# EasyEDA Pro project COBOT_Braço_Robotico.eprj

# Schematic Esquema Geral

## Sheets
1 Servos Motores: Board Name: Board1; Create Date: 2025-11-12; Page Name: Servos Motores; Project Name: COBOT_Braço_Robotico; Schematic Name: Esquema Geral; Update Date: 2025-11-13; Company: EasyEDA.com; Page Size: A4; Version: V1.0
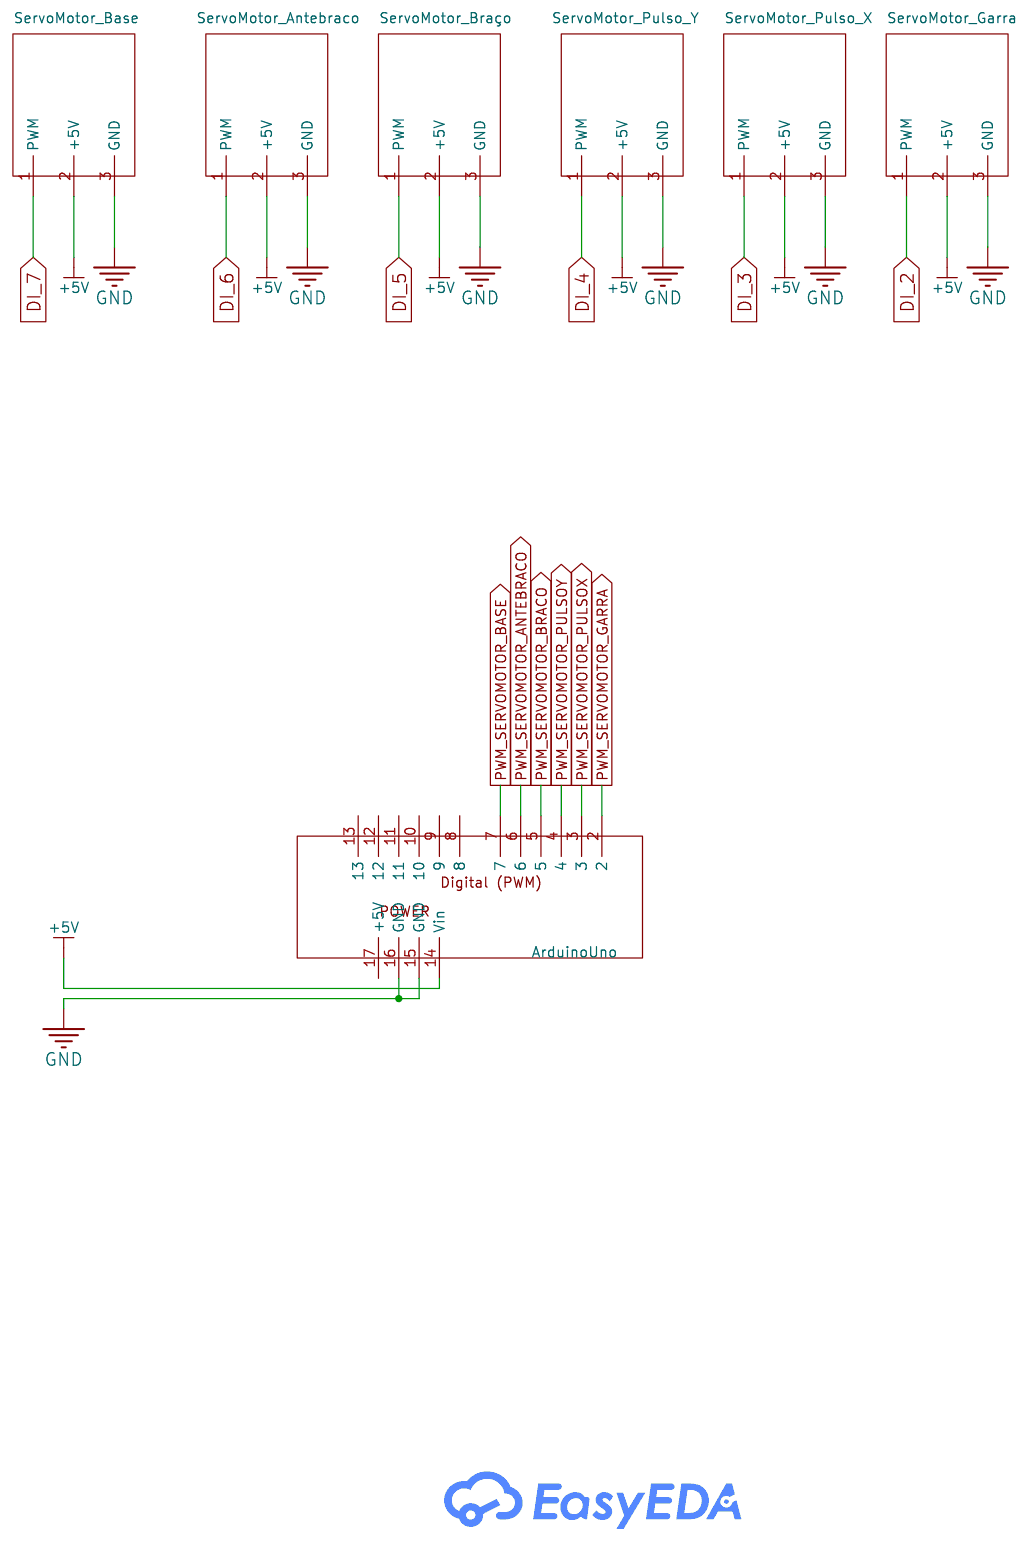
[diagram p0: Servos Motores]
2 Tapetes: Create Date: 2025-11-13; Page Name: Tapetes
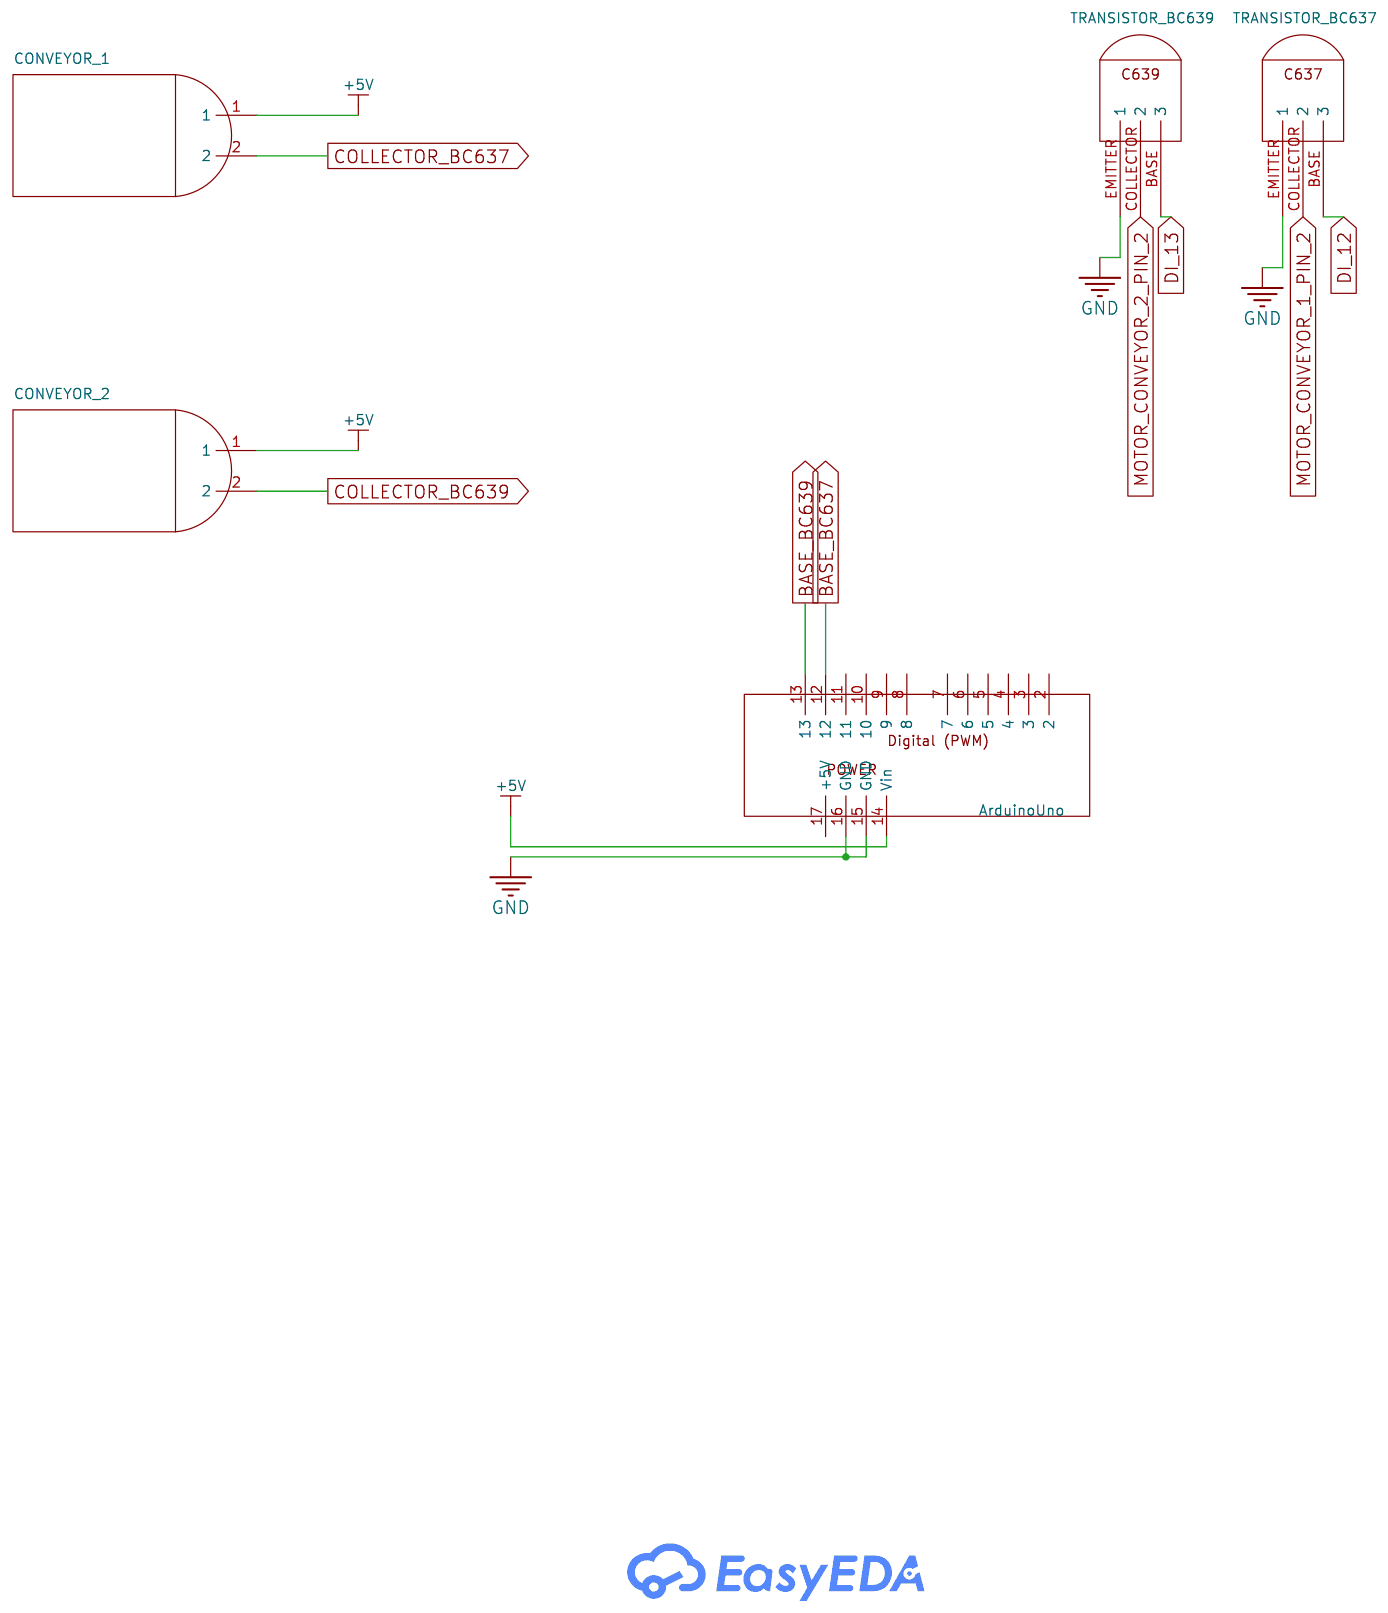
[diagram p1: Tapetes]
3 Sensores Ultrassonico: Create Date: 2025-11-13; Page Name: Sensores Ultrassonico
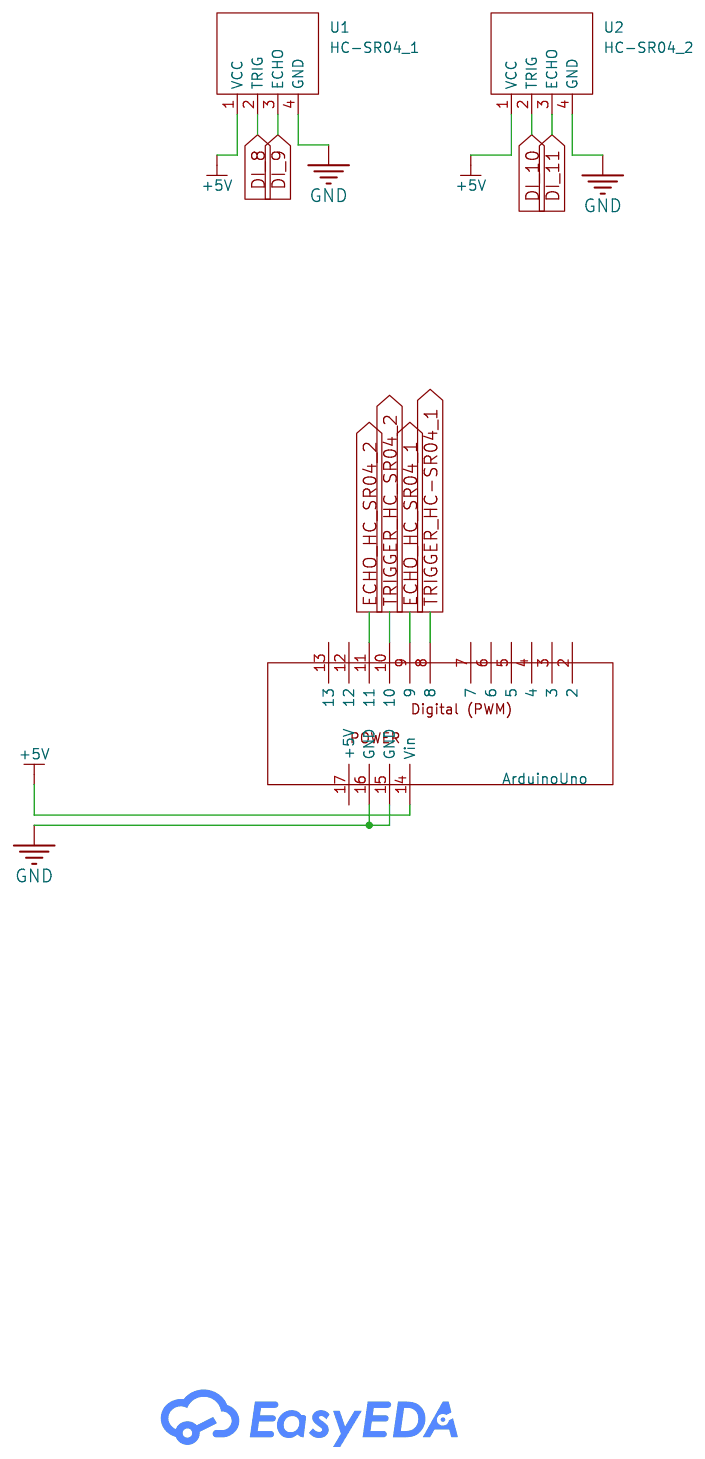
[diagram p2: Sensores Ultrassonico]

## Parts
sheet Sensores Ultrassonico
ArduinoUno#3  -
U1  HC-SR04_1  [TH_HC-SR04V]
U2  HC-SR04_2  [TH_HC-SR04V]
sheet Servos Motores
ArduinoUno  -
ServoMotor_Antebraco  -
ServoMotor_Base  -
ServoMotor_Braço  -
ServoMotor_Garra  -
ServoMotor_Pulso_X  -
ServoMotor_Pulso_Y  -
sheet Tapetes
ArduinoUno#2  -
CONVEYOR_1  -
CONVEYOR_2  -
TRANSISTOR_BC637  -
TRANSISTOR_BC639  -

## Library data of the parts
ArduinoUno ArduinoUno#2 ArduinoUno#3 = Arduino Uno
U1 U2 = HC-SR04: Supplier Part: C19857336; Manufacturer: Universal Microelectronics; JLCPCB Part Class: Extended Part; Datasheet: https://atta.szlcsc.com/upload/public/pdf/source/20240122/47B8E374E428935B7962A2189EF91AAC.pdf; Supplier: LCSC
ServoMotor_Antebraco ServoMotor_Base ServoMotor_Braço ServoMotor_Garra ServoMotor_Pulso_X ServoMotor_Pulso_Y = Servo Motor
CONVEYOR_1 CONVEYOR_2 = Motor_arduino
TRANSISTOR_BC637 = Transistor BC637
TRANSISTOR_BC639 = Transistor BC639

## Nets
+5V: ArduinoUno.14(Vin) ArduinoUno#2.14(Vin) ArduinoUno#3.14(Vin) CONVEYOR_1.1 CONVEYOR_2.1 ServoMotor_Antebraco.2(+5V) ServoMotor_Base.2(+5V) ServoMotor_Braço.2(+5V) ServoMotor_Garra.2(+5V) ServoMotor_Pulso_X.2(+5V) ServoMotor_Pulso_Y.2(+5V) U1.1(VCC) U2.1(VCC)
GND: ArduinoUno.15(GND) ArduinoUno.16(GND) ArduinoUno#2.15(GND) ArduinoUno#2.16(GND) ArduinoUno#3.15(GND) ArduinoUno#3.16(GND) ServoMotor_Antebraco.3(GND) ServoMotor_Base.3(GND) ServoMotor_Braço.3(GND) ServoMotor_Garra.3(GND) ServoMotor_Pulso_X.3(GND) ServoMotor_Pulso_Y.3(GND) TRANSISTOR_BC637.EMITTER(1) TRANSISTOR_BC639.EMITTER(1) U1.4(GND) U2.4(GND)
BASE_BC637: ArduinoUno#2.12
BASE_BC639: ArduinoUno#2.13
COLLECTOR_BC637: CONVEYOR_1.2
COLLECTOR_BC639: CONVEYOR_2.2
DI_2: ServoMotor_Garra.1(PWM)
DI_3: ServoMotor_Pulso_X.1(PWM)
DI_4: ServoMotor_Pulso_Y.1(PWM)
DI_5: ServoMotor_Braço.1(PWM)
DI_6: ServoMotor_Antebraco.1(PWM)
DI_7: ServoMotor_Base.1(PWM)
DI_8: U1.2(TRIG)
DI_9: U1.3(ECHO)
DI_10: U2.2(TRIG)
DI_11: U2.3(ECHO)
DI_12: TRANSISTOR_BC637.BASE(3)
DI_13: TRANSISTOR_BC639.BASE(3)
ECHO_HC_SR04_1: ArduinoUno#3.9
ECHO_HC_SR04_2: ArduinoUno#3.11
MOTOR_CONVEYOR_1_PIN_2: TRANSISTOR_BC637.COLLECTOR(2)
MOTOR_CONVEYOR_2_PIN_2: TRANSISTOR_BC639.COLLECTOR(2)
PWM_SERVOMOTOR_ANTEBRACO: ArduinoUno.6
PWM_SERVOMOTOR_BASE: ArduinoUno.7
PWM_SERVOMOTOR_BRACO: ArduinoUno.5
PWM_SERVOMOTOR_GARRA: ArduinoUno.2
PWM_SERVOMOTOR_PULSOX: ArduinoUno.3
PWM_SERVOMOTOR_PULSOY: ArduinoUno.4
TRIGGER_HC-SR04_1: ArduinoUno#3.8
TRIGGER_HC_SR04_2: ArduinoUno#3.10

Not connected (* = marked no-connect by the designer): ArduinoUno 8 9 10 11 12 13 17(+5V); ArduinoUno#2 2 3 4 5 6 7 8 9 10 11 17(+5V); ArduinoUno#3 2 3 4 5 6 7 12 13 17(+5V)
